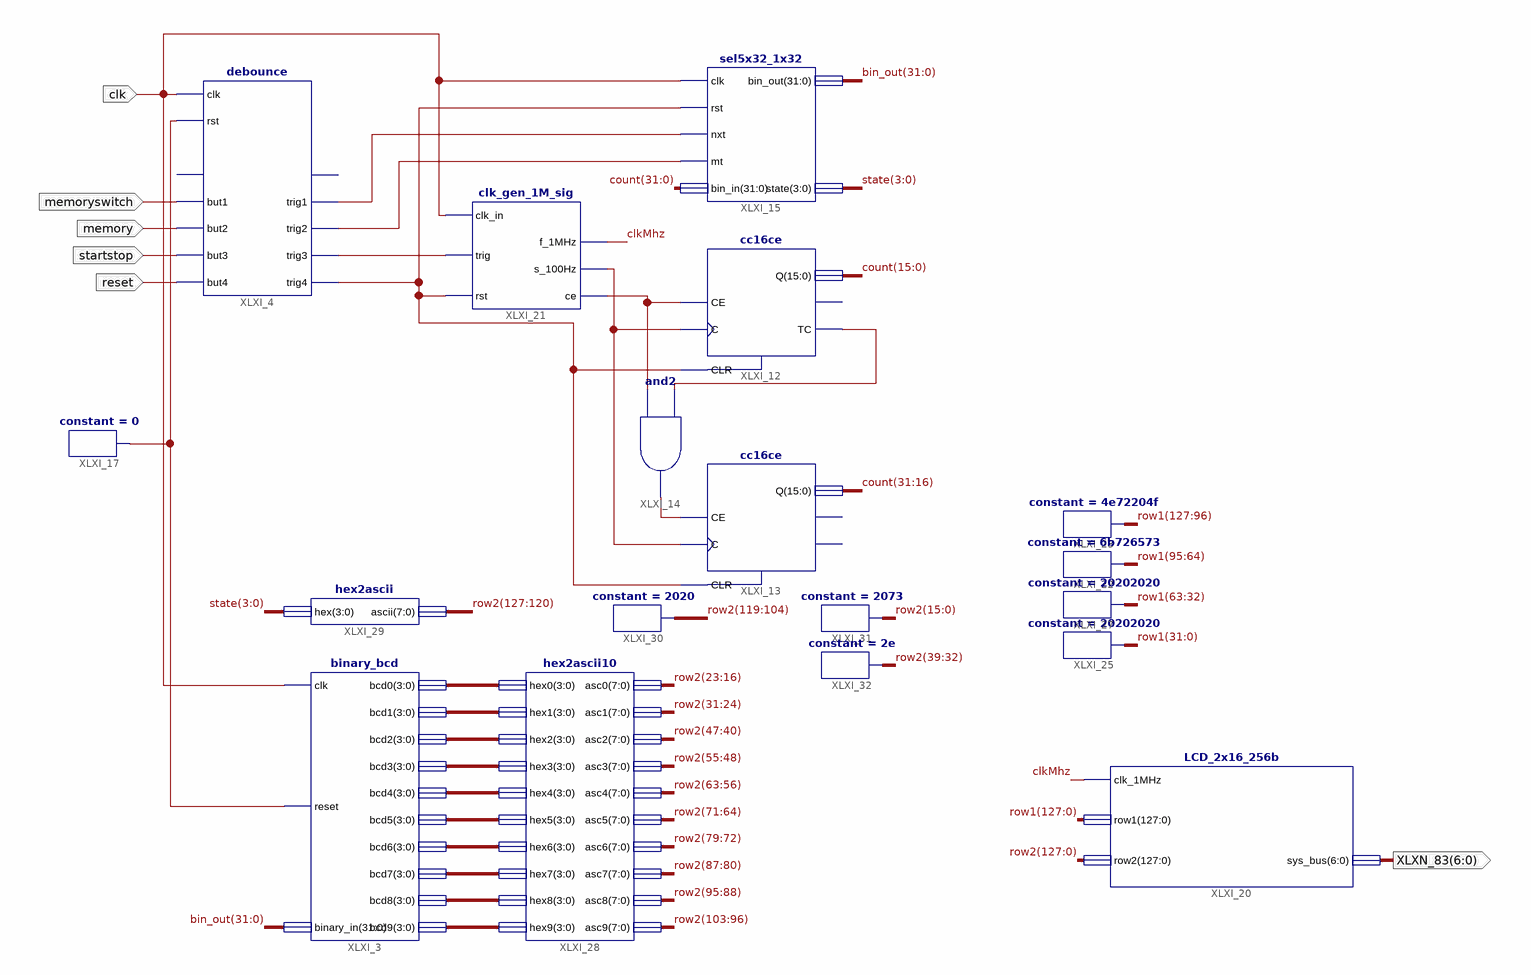
[diagram p0: schematic sheet 1]
// Xilinx ISE schematic pomiarT.sch (spartan3e) as structural Verilog: 18 symbols, 6 ports
module pomiarT (
  input  reset,
  input  startstop,
  input  memory,
  input  memoryswitch,
  input  clk,
  output [6:0] XLXN_83
);

  wire clkMhz, XLXN_3, XLXN_4, XLXN_5, XLXN_6, XLXN_27, XLXN_31, XLXN_32, XLXN_34, XLXN_41;
  wire [3:0] state, XLXN_84, XLXN_85, XLXN_86, XLXN_87, XLXN_88, XLXN_89, XLXN_90, XLXN_91, XLXN_92, XLXN_93;
  wire [31:0] bin_out, count;
  wire [127:0] row1, row2;

  binary_bcd XLXI_3 (
    .clk(clk), .reset(XLXN_34), .binary_in(bin_out), .bcd0(XLXN_84), .bcd1(XLXN_85), .bcd2(XLXN_86),
    .bcd3(XLXN_87), .bcd4(XLXN_88), .bcd5(XLXN_89), .bcd6(XLXN_90), .bcd7(XLXN_91), .bcd8(XLXN_92),
    .bcd9(XLXN_93));
  debounce XLXI_4 (
    .clk(clk), .rst(XLXN_34), .but1(memoryswitch), .but2(memory), .but3(startstop), .but4(reset),
    .trig1(XLXN_32), .trig2(XLXN_31), .trig3(XLXN_41), .trig4(XLXN_27));  // open: but0, trig0
  cc16ce XLXI_12 (.C(XLXN_6), .CE(XLXN_5), .CLR(XLXN_27), .Q(count[15:0]), .TC(XLXN_4));  // open: CEO
  cc16ce XLXI_13 (.C(XLXN_6), .CE(XLXN_3), .CLR(XLXN_27), .Q(count[31:16]));  // open: CEO, TC
  and XLXI_14 (XLXN_3, XLXN_5, XLXN_4);
  sel5x32_1x32 XLXI_15 (
    .clk(clk), .rst(XLXN_27), .nxt(XLXN_32), .mt(XLXN_31), .bin_in(count), .bin_out(bin_out), .state(state));
  constant #(.CValue("0")) XLXI_17 (.O(XLXN_34));
  LCD_2x16_256b #(.PmodName("JC")) XLXI_20 (.clk_1MHz(clkMhz), .row2(row2), .row1(row1), .sys_bus(XLXN_83));
  clk_gen_1M_sig XLXI_21 (.clk_in(clk), .trig(XLXN_41), .rst(XLXN_27), .f_1MHz(clkMhz), .s_100Hz(XLXN_6), .ce(XLXN_5));
  constant #(.CValue("6b726573")) XLXI_22 (.O(row1[95:64]));
  constant #(.CValue("4e72204f")) XLXI_23 (.O(row1[127:96]));
  constant #(.CValue("20202020")) XLXI_25 (.O(row1[31:0]));
  constant #(.CValue("20202020")) XLXI_27 (.O(row1[63:32]));
  hex2ascii10 XLXI_28 (
    .hex0(XLXN_84), .hex1(XLXN_85), .hex2(XLXN_86), .hex3(XLXN_87), .hex4(XLXN_88), .hex5(XLXN_89),
    .hex6(XLXN_90), .hex7(XLXN_91), .hex8(XLXN_92), .hex9(XLXN_93), .asc0(row2[23:16]), .asc1(row2[31:24]),
    .asc2(row2[47:40]), .asc3(row2[55:48]), .asc4(row2[63:56]), .asc5(row2[71:64]), .asc6(row2[79:72]),
    .asc7(row2[87:80]), .asc8(row2[95:88]), .asc9(row2[103:96]));
  hex2ascii XLXI_29 (.hex(state), .ascii(row2[127:120]));
  constant #(.CValue("2020")) XLXI_30 (.O(row2[119:104]));
  constant #(.CValue("2073")) XLXI_31 (.O(row2[15:0]));
  constant #(.CValue("2e")) XLXI_32 (.O(row2[39:32]));

  // Notes on the sheet:
  //   LOC on signal reset = D18
  //   LOC on signal startstop = B18
  //   LOC on signal memory = E18
  //   LOC on signal memoryswitch = H13
  //   LOC on signal clk = B8
endmodule
